# Altium schematic sheet V1.SchDoc
size B
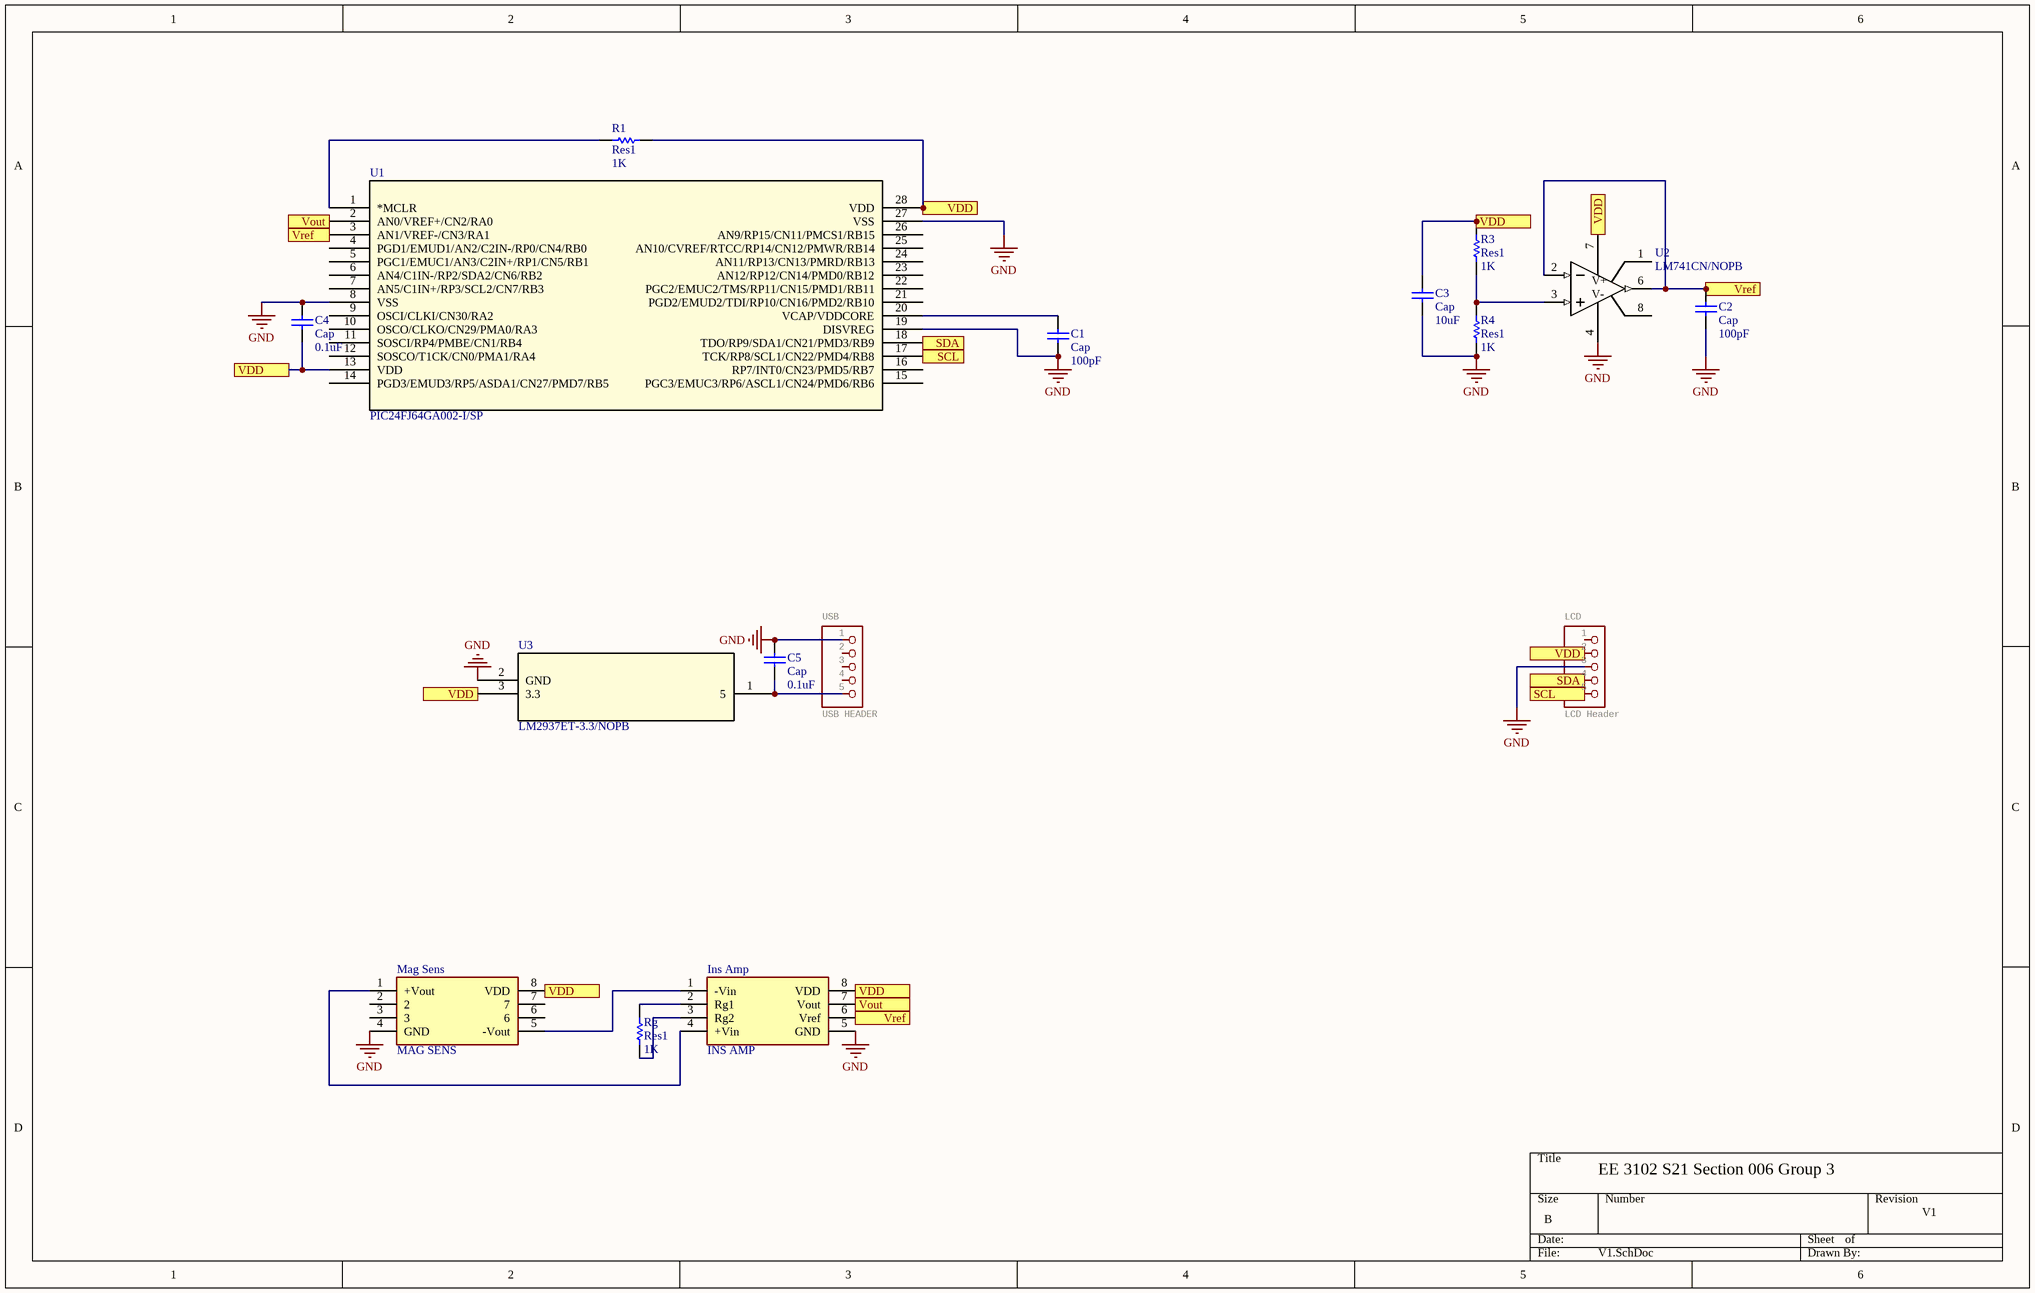
[diagram p0: V1.SchDoc]

## Parts
C1  Cap  value 100pF  [RAD-0.3]
C2  Cap  value 100pF  [RAD-0.3]
C3  Cap  value 10uF  [RAD-0.3]
C4  Cap  value 0.1uF  [RAD-0.3]
C5  Cap  value 0.1uF  [RAD-0.3]
Ins_Amp  INS AMP  [0835000011RC]
LCD  LCD Header  [1X05_ROUND_70]
Mag_Sens  MAG SENS  [0835000011RC]
R1  Res1  value 1K  [AXIAL-0.3]
R3  Res1  value 1K  [AXIAL-0.3]
R4  Res1  value 1K  [AXIAL-0.3]
Rg  Res1  value 1K  [AXIAL-0.3]
U1  PIC24FJ64GA002-I/SP  [SPDIP28_300MC_MCH]
U2  LM741CN/NOPB  [LM741 Custom Footprint]
U3  LM2937ET-3.3/NOPB  [T03B]
USB  USB HEADER  [1X05_ROUND_70]

## Ports
SCL, SDA, VDD, Vout, Vref

## Nets
GND: C1.1 C2.1 C3.1 C4.2 C5.2 Ins_Amp.5(GND) LCD.3 Mag_Sens.4(GND) R4.1 U1.8(VSS) U1.19(DISVREG) U1.27(VSS) U2.4(V-) U3.2(GND) USB.1
SCL: LCD.5 U1.17(TCK/RP8/SCL1/CN22/PMD4/RB8) ; port SCL
SDA: LCD.4 U1.18(TDO/RP9/SDA1/CN21/PMD3/RB9) ; port SDA
VDD: C3.2 C4.1 Ins_Amp.8(VDD) LCD.2 Mag_Sens.8(VDD) R1.1 R3.2 U1.13(VDD) U1.28(VDD) U2.7(V+) U3.3(3.3) ; port VDD
Vout: Ins_Amp.7(Vout) U1.2(AN0/VREF+/CN2/RA0) ; port Vout
Vref: C2.2 Ins_Amp.6(Vref) U1.3(AN1/VREF-/CN3/RA1) U2.2(IN-) U2.6(OUT) ; port Vref
NetC1_2: C1.2 U1.20(VCAP/VDDCORE)
NetC5_1: C5.1 U3.1(5) USB.5
NetIns_Amp_1: Ins_Amp.1(-Vin) Mag_Sens.5(-Vout)
NetIns_Amp_2: Ins_Amp.2(Rg1) Rg.2
NetIns_Amp_3: Ins_Amp.3(Rg2) Rg.1
NetIns_Amp_4: Ins_Amp.4(+Vin) Mag_Sens.1(+Vout)
NetR1_2: R1.2 U1.1(*MCLR)
NetR3_1: R3.1 R4.2 U2.3(IN+)

Not connected (* = marked no-connect by the designer): LCD 1; Mag_Sens 2 3 6 7; U1 4(PGD1/EMUD1/AN2/C2IN-/RP0/CN4/RB0) 5(PGC1/EMUC1/AN3/C2IN+/RP1/CN5/RB1) 6(AN4/C1IN-/RP2/SDA2/CN6/RB2) 7(AN5/C1IN+/RP3/SCL2/CN7/RB3) 9(OSCI/CLKI/CN30/RA2) 10(OSCO/CLKO/CN29/PMA0/RA3) 11(SOSCI/RP4/PMBE/CN1/RB4) 12(SOSCO/T1CK/CN0/PMA1/RA4) 14(PGD3/EMUD3/RP5/ASDA1/CN27/PMD7/RB5) 15(PGC3/EMUC3/RP6/ASCL1/CN24/PMD6/RB6) 16(RP7/INT0/CN23/PMD5/RB7) 21(PGD2/EMUD2/TDI/RP10/CN16/PMD2/RB10) 22(PGC2/EMUC2/TMS/RP11/CN15/PMD1/RB11) 23(AN12/RP12/CN14/PMD0/RB12) 24(AN11/RP13/CN13/PMRD/RB13) 25(AN10/CVREF/RTCC/RP14/CN12/PMWR/RB14) 26(AN9/RP15/CN11/PMCS1/RB15); U2 1(BAL1) 8(BAL2); USB 2 3 4

## Notes on the sheet
- EE 3102 S21 Section 006 Group 3
- V1

## Library data of the parts
C1-C5 = Cap: Capacitor; Published: 8-Jun-2000; LatestRevisionDate: 17-Jul-2002; LatestRevisionNote: Re-released for DXP Platform.; PackageReference: RAD-0.3; Publisher: Altium Limited; PackageDescription: Radial Cap, Thru-Hole; 2 Leads; 0.3 in Pin Spacing
Ins_Amp Mag_Sens = 08-350000-11-RC: Connector; Manufacturer_Name: ARIES; Datasheet Link: https://componentsearchengine.com/Datasheets/2/08-350000-11-RC.pdf; Height: 2.09mm; Manufacturer_Part_Number: 08-350000-11-RC; Mouser Part Number: 535-08-350000-11-RC; Mouser Price/Stock: https://www.mouser.co.uk/ProductDetail/Aries-Electronics/08-350000-11-RC/?qs=ke0bxZO6vzv2wOqUZXyEcQ%3D%3D
LCD = HEADER-1X570MIL: PIN HEADER for; GateName_1: A; SymbolName_1: PINHD5; DeviceName: 70MIL; LibraryName: microbuilder; DeviceSetName: HEADER-1X5
R1 R3 R4 Rg = Res1: Resistor; Published: 8-Jun-2000; LatestRevisionDate: 17-Jul-2002; LatestRevisionNote: Re-released for DXP Platform.; PackageReference: AXIAL-0.3; Publisher: Altium Limited; PackageDescription: Axial Device, Thru-Hole; 2 Leads; 0.3 in Pin Spacing
U1 = PIC24FJ64GA002-I/SP: No Description Available; Vendor: Microchip; Built_By: EMA_Jessica; SourceLibrary: Microchip_2019-08-23_10; Manufacturer_Part_Number: PIC24FJ64GA002-I/SP; Copyright: Copyright (C) 2018 Accelerated Designs. All rights reserved; RefDes: RefDes; Type: DEV
U2 = LM741CN/NOPB: No Description Available; Manufacturer: NationalSemiconductor; Characteristics: LM741CNGeneralPurposeOpAmp; CompType: OpAmpIC; TaMin_C: 00; TaMax_C: 700; Sim: NoteBalancepinsnotmodeled; ComponentLink1DescBC: LM741Datasheet; ComponentLink2DescA4: LM741WebPage; ComponentLink3DescAC: N08EPackageWebPage; Copyright: Copyright (C) 2018 Accelerated Designs. All rights reserved; SymbolVersion: 2008-07-09; PartNumber: LM741CN; PackageDescription: 8LeadPlasticDIP; PackageReference: N08E_L; RoHS: O; ComponentLink1URL: http//wwwnationalcom/ds/LM/LM741pdf; ComponentLink2URL: http//wwwnationalcom/pf/LM/LM741html; ComponentLink3URL: http//wwwnationalcom/packaging/folders/n08ehtml; Version: B1608; LatestRevisionDate: 2009-03-16; LatestRevisionNote: MassUpdate; Publisher: NationalSemiconductor; Published: 2009-03-16
U3 = LM2937ET-3.3/NOPB: No Description Available; PartNumber: LM2937ET-10; Comp: TypeLDO; Vendor: NationalSemiconductor; base_pn: LM2937; Symbol: NameLM2937ET-10; Library: ReferenceLM2937ET; Type: DEV; Version: 1; Pin: Count3; Copyright: Copyright (C) 2018 Accelerated Designs. All rights reserved; RefDes: RefDes
USB = HEADER-1X570MIL: PIN HEADER; GateName_1: A; SymbolName_1: PINHD5; DeviceName: 70MIL; LibraryName: microbuilder; DeviceSetName: HEADER-1X5